# EAGLE design reza-power (EAGLE 6.4)
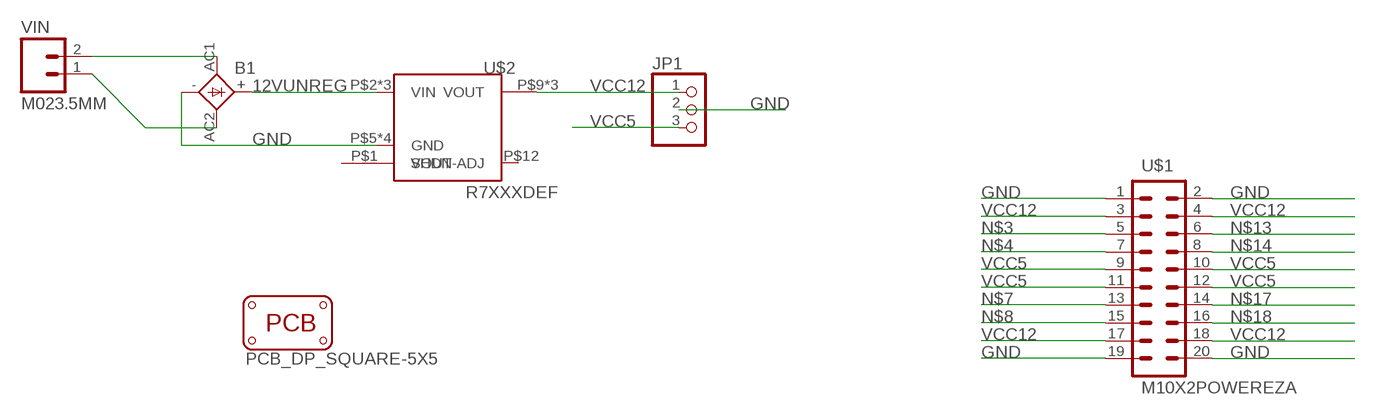
[diagram p0: schematic, sheet 1]

## Parts
B1  1KAB  [1KAB]
JP1  PINHD-1X3CB  [1X03-CLEANBIG]
PCB1  PCB_DP_SQUARE-5X5  [DP5050_V1]
U$1  M10X2POWEREZA  [REZAPOWER_INTERBOARD]
U$2  R7XXXDEF  [1X12_RECOM]
VIN  M023.5MM  [SCREWTERMINAL-3.5MM-2]

## Nets
12VUNREG [Power]: B1.+ U$2.P$2(VIN) U$2.P$3(VIN) U$2.P$4(VIN)
24VAC1 [Power]: B1.AC2 VIN.1
24VAC2 [Power]: B1.AC1 VIN.2
GND [Power]: B1.- JP1.2 U$1.1 U$1.2 U$1.19 U$1.20 U$2.P$5(GND) U$2.P$6(GND) U$2.P$7(GND) U$2.P$8(GND)
N$3: U$1.5
N$4: U$1.7
N$7: U$1.13
N$8: U$1.15
N$13: U$1.6
N$14: U$1.8
N$17: U$1.14
N$18: U$1.16
VCC5: JP1.3 U$1.9 U$1.10 U$1.11 U$1.12
VCC12 [Power]: JP1.1 U$1.3 U$1.4 U$1.17 U$1.18 U$2.P$9(VOUT) U$2.P$10(VOUT) U$2.P$11(VOUT)
Unconnected: U$2.P$1(SHDN) U$2.P$12(VOUT-ADJ)

## Library data of the parts
B1 = rectifier:1KAB: RECTIFIER grid 5,08 x 5,08 mm
JP1 = adafruit:PINHD-1X3: PIN HEADER
PCB1 = dp_pcb:PCB_DP_SQUARE: Dangerous Prototypes Standard Square PCB sizes
U$1 = 0_jc-custom-eagle6:M10X2: This was SPECIALLY designed to be used with our Graphic LCD Backpack. Be sure you want to use this! It is not only staggered on each line of header holes, but IT IS ALSO offset of the center point of the top and bottom lines by 5 mil. This causes the headers to lock into place on the "standard" footprint on the LCD screen. The extra squares on the tdocu layer are there simply to reference other pins (if you were to actually populate a longer header than ten long - this is what we do with the backpacks).
U$2 = 0_jc-custom-eagle6:R7XXX
VIN = SparkFun-Connectors:M02: Standard 2-pin 0.1" header. Use with - straight break away headers ( PRT-00116) - right angle break away headers (PRT-00553) - swiss pins (PRT-00743) - machine pins (PRT-00117) - female headers (PRT-00115) Molex polarized connector foot print use with: PRT-08233 with associated crimp pins and housings. 2.54_SCREWTERM for use with PRT-10571. 3.5mm Screw Terminal footprints for PRT-08084 5mm Screw Terminal footprints for use with PRT-08433

## Net classes
0 default: width 0.254 mm
2 Power: width 0.762 mm

## Board
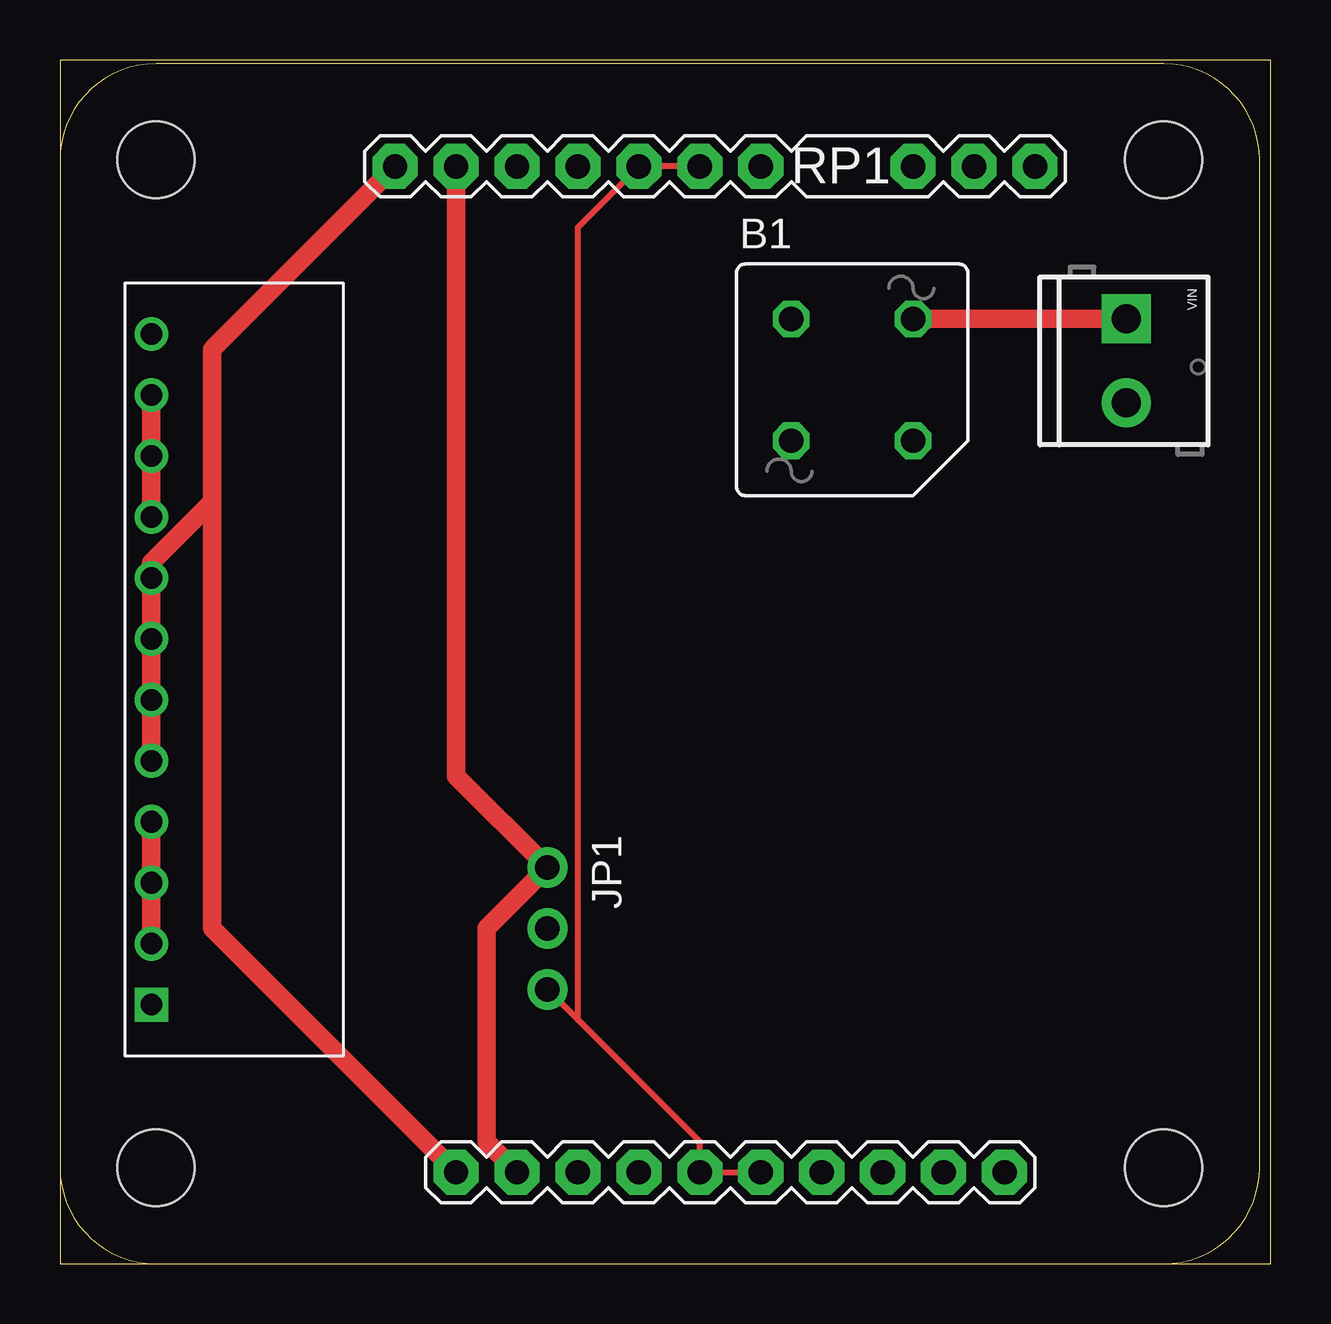
[diagram p1: board, top side]
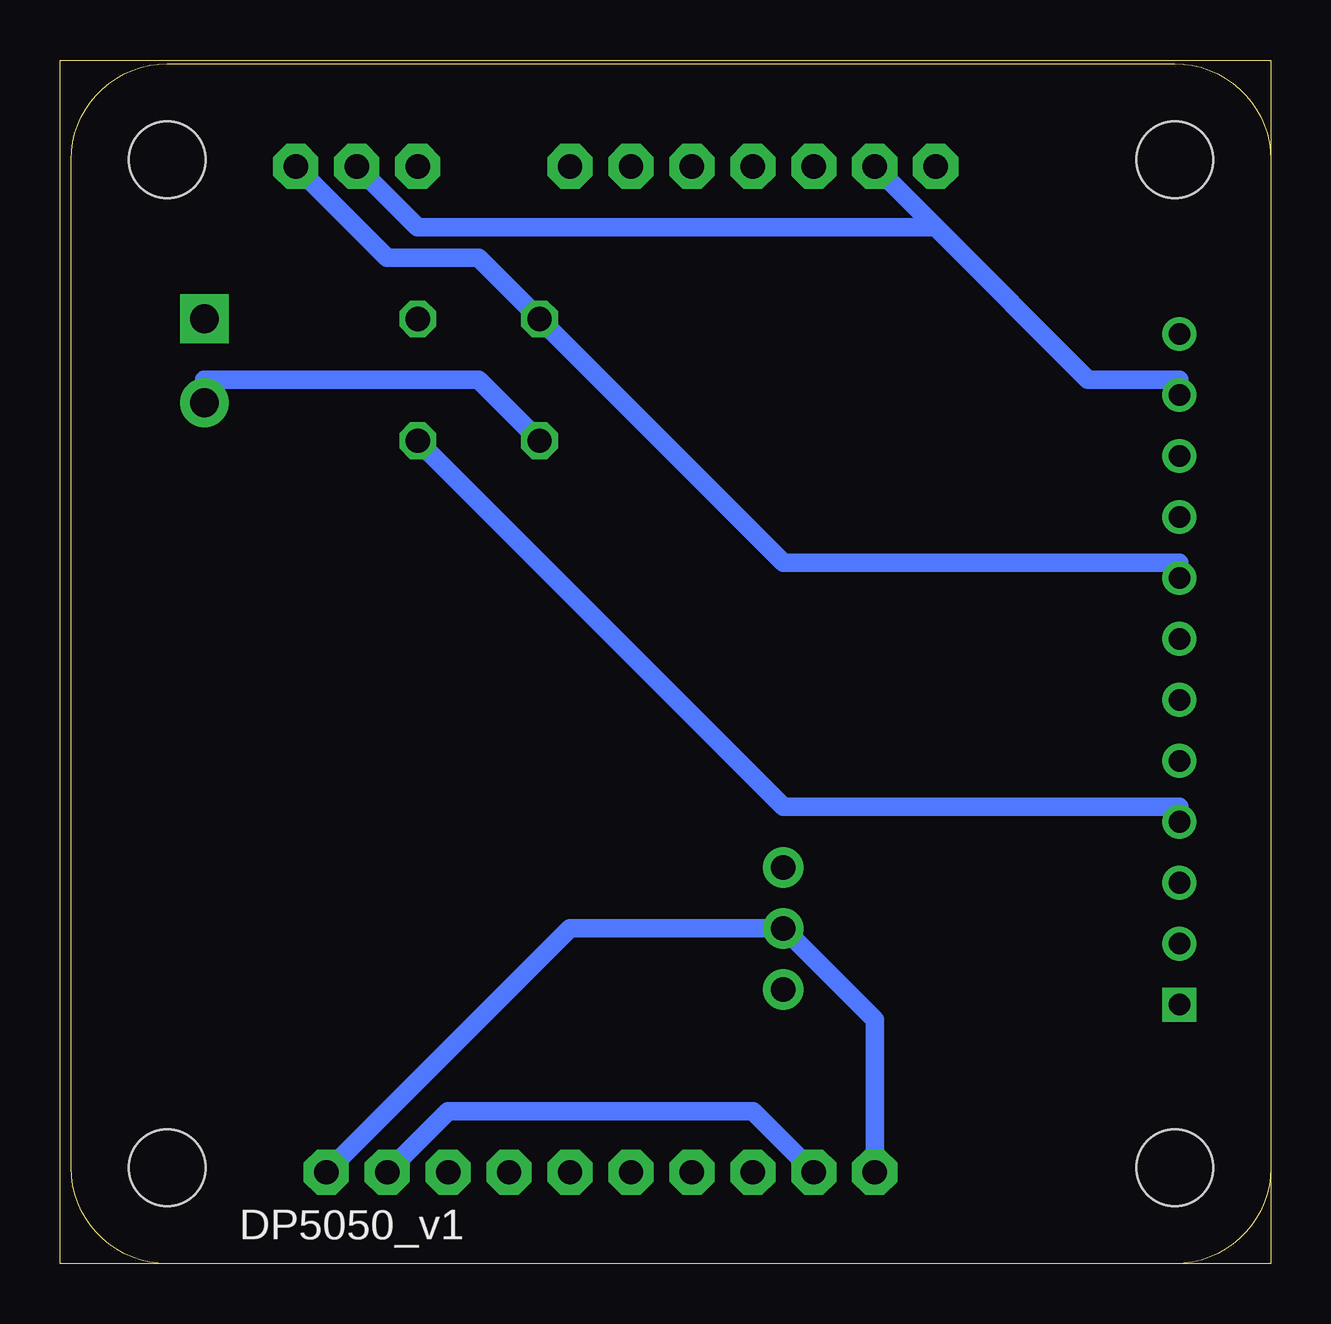
[diagram p2: board, bottom side, seen from below]

Size 50.47 x 50.16 mm. Coordinates in mm from the lower left corner, seen from the top.
Outline: 0,0 50.47,0 50.47,50.16 0,50.16 0,0
Copper layers (1*16): Top 0.035mm / dielectric 1.5mm / Bottom 0.035mm
Design rules "default": minimum track width 10mil, minimum drill 24mil, track to track 8mil, track to pad 8mil, pad to pad 8mil, via to via 8mil, smd to smd 8mil, copper to edge 40mil, drill to drill 8mil, minimum pad ring 10mil, minimum via ring 8mil, stop-mask expansion 4mil, vias tented up to drill 0mil, thermal gap 10mil

### Footprints (pad centres in the part's own frame; a part is rotated, then mirrored left to right if it is on the bottom)
1KAB = drill 1.016 octagon: + 2.54,-2.54; - -2.54,2.54; AC1 -2.54,-2.54; AC2 2.54,2.54
1X03-CLEANBIG = drill 1.016 pad 1.676: 1 -2.54,0; 2 0,0; 3 2.54,0
DP5050_V1 = hole 3.2: 4,4; 46,4; 46,46; 4,46
REZAPOWER_INTERBOARD = drill 1.016 pad 1.88 octagon: 1 -11.43,-20.32; 2 -13.97,21.59; 3 -8.89,-20.32; 4 -11.43,21.59; 5 -6.35,-20.32; 6 -8.89,21.59; 7 -3.81,-20.32; 8 -6.35,21.59; 9 -1.27,-20.32; 10 -3.81,21.59; 11 1.27,-20.32; 12 -1.27,21.59; 13 3.81,-20.32; 14 1.27,21.59; 15 6.35,-20.32; 16 7.62,21.59; 17 8.89,-20.32; 18 10.16,21.59; 19 11.43,-20.32; 20 12.7,21.59
1X12_RECOM = drill 0.9 square: P$1 -13.97,0 | drill 0.9: P$2 -11.43,0; P$3 -8.89,0; P$4 -6.35,0; P$5 -3.81,0; P$6 -1.27,0; P$7 1.27,0; P$8 3.81,0; P$9 6.35,0; P$10 8.89,0; P$11 11.43,0; P$12 13.97,0
SCREWTERMINAL-3.5MM-2 = drill 1.2 pad 2.032 square: 1 0,0 | drill 1.2 pad 2.032: 2 3.5,0

### Placement (x,y rotation side)
B1  33.02,36.83 0 top
JP1  20.32,13.97 270 top
PCB1  0,0 0 top
U$1  27.94,24.13 0 top
U$2  3.81,24.77 90 top
VIN  44.45,39.37 270 top

### Tracks (layer width: path | path; a pad name or v marks a point on that pad's centre or on a via)
12VUNREG
  Top 0.762: U$2.P$2 U$2.P$3 U$2.P$4
  Bottom 0.762: B1.+ 20.32,19.05 3.81,19.05 U$2.P$4
24VAC1
  Top 0.762: VIN.1 B1.AC2
24VAC2
  Bottom 0.762: B1.AC1 33.02,36.83 44.45,36.83 VIN.2
GND
  Top 0.762: U$2.P$5 U$2.P$6 U$2.P$7 U$2.P$8 3.81,29.21 6.35,31.75 | U$1.2 6.35,38.1 6.35,31.75 | U$1.1 6.35,13.97 6.35,31.75
  Bottom 0.762: U$1.1 16.51,10.16 JP1.2 29.21,13.97 U$1.19 | U$1.20 36.83,41.91 33.02,41.91 B1.- 20.32,29.21 3.81,29.21 U$2.P$8
VCC5
  Top 0.254: U$1.12 U$1.10 21.59,43.18 21.59,10.16 | 21.59,10.16 26.67,5.08 U$1.9 U$1.11 | 21.59,10.16 JP1.3
VCC12
  Top 0.762: U$1.3 17.78,5.08 17.78,13.97 JP1.1 16.51,20.32 U$1.4 | U$2.P$9 U$2.P$10 U$2.P$11
  Bottom 0.762: U$1.17 34.29,6.35 21.59,6.35 U$1.3 | 13.97,43.18 7.62,36.83 3.81,36.83 U$2.P$11 | 13.97,43.18 U$1.4 | U$1.18 35.56,43.18 13.97,43.18